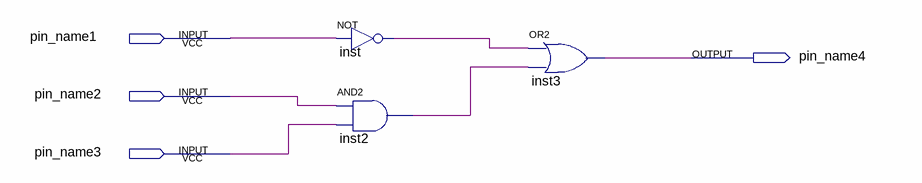
[diagram p0: schematic sheet]
// Quartus schematic teste.bdf as structural Verilog: 3 symbols, 4 pins
module teste (
  input  pin_name1,
  input  pin_name2,
  input  pin_name3,
  output pin_name4
);

  wire inst2_out, inst_out;

  not inst (inst_out, pin_name1);
  and inst2 (inst2_out, pin_name2, pin_name3);
  or inst3 (pin_name4, inst_out, inst2_out);
endmodule
